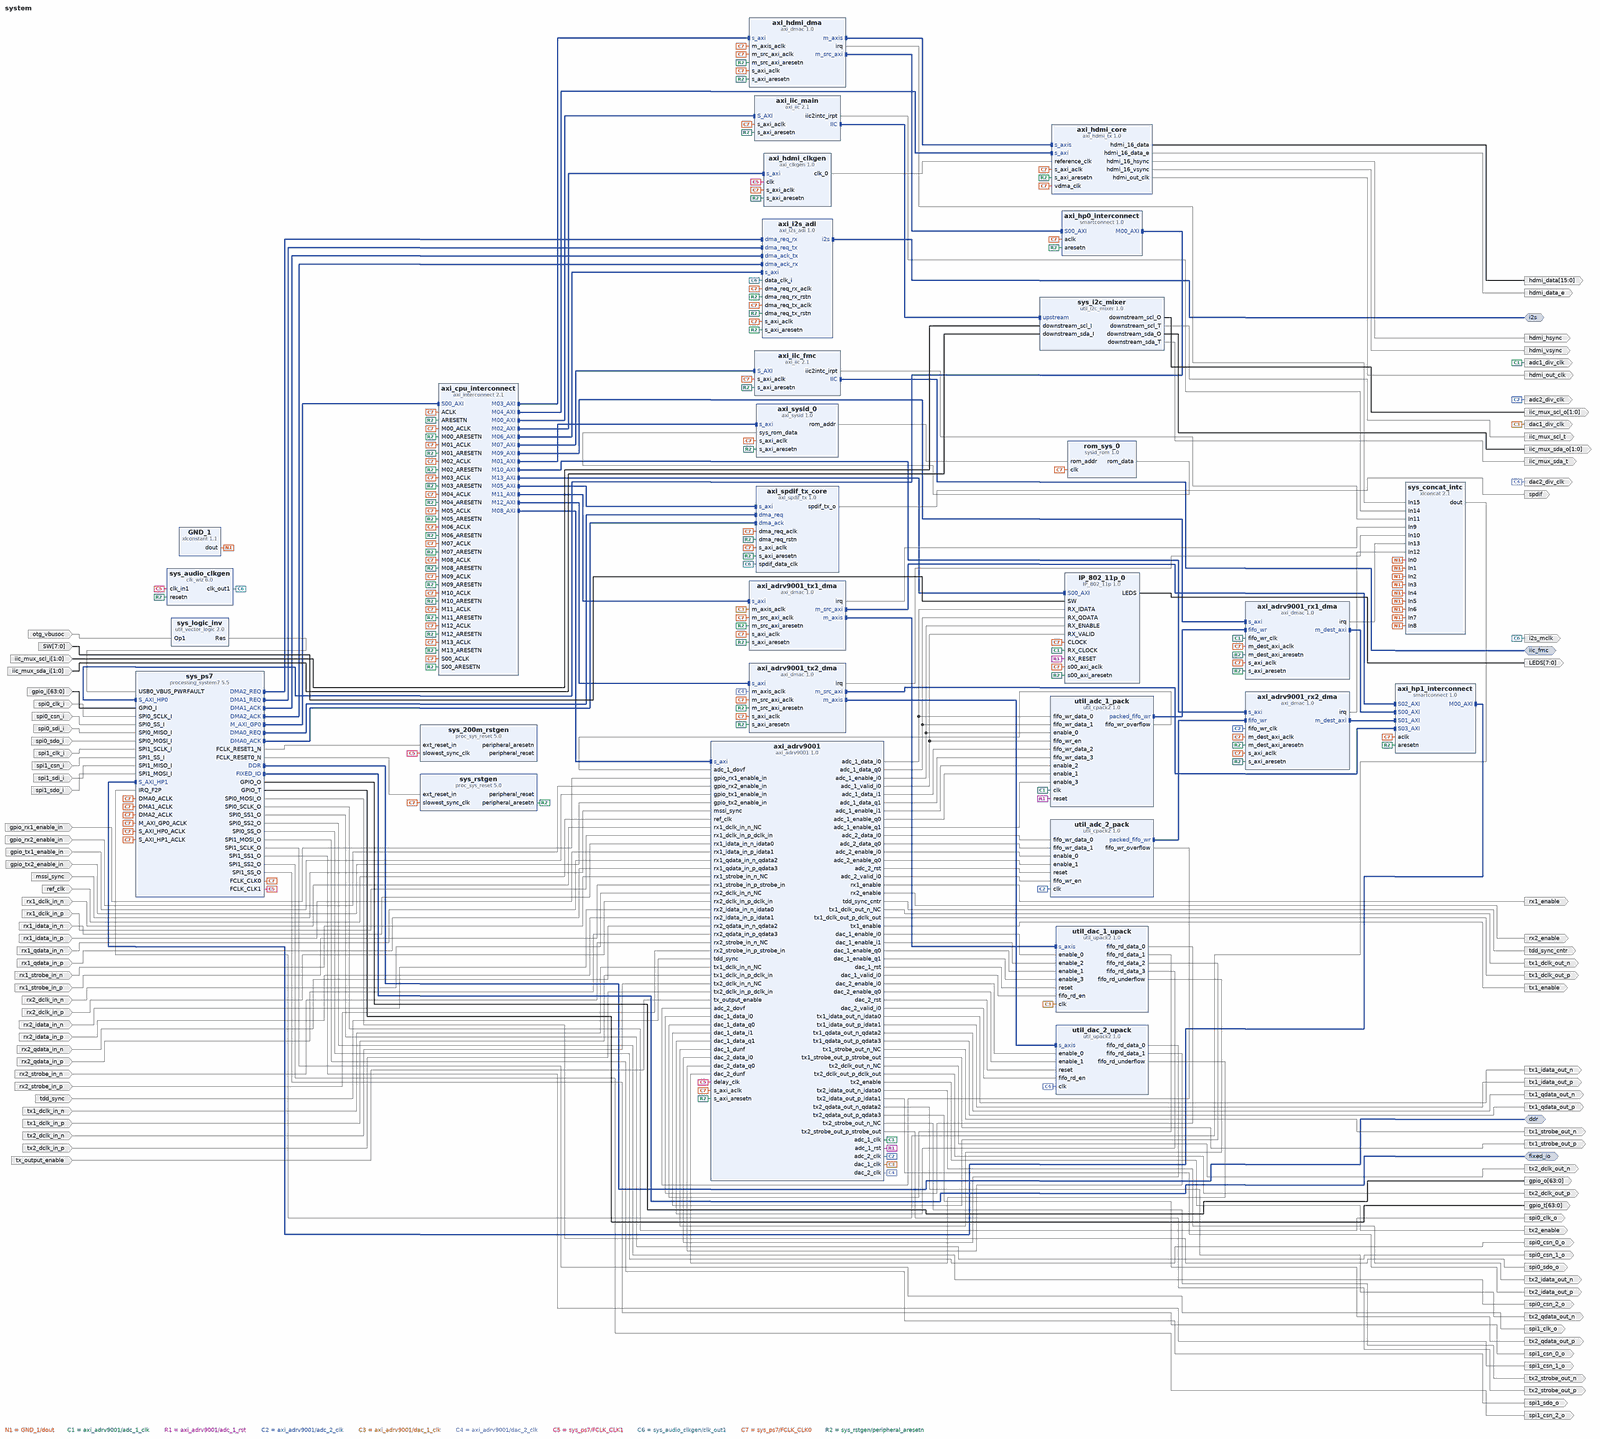
[diagram p0: block diagram of the top level, whole]
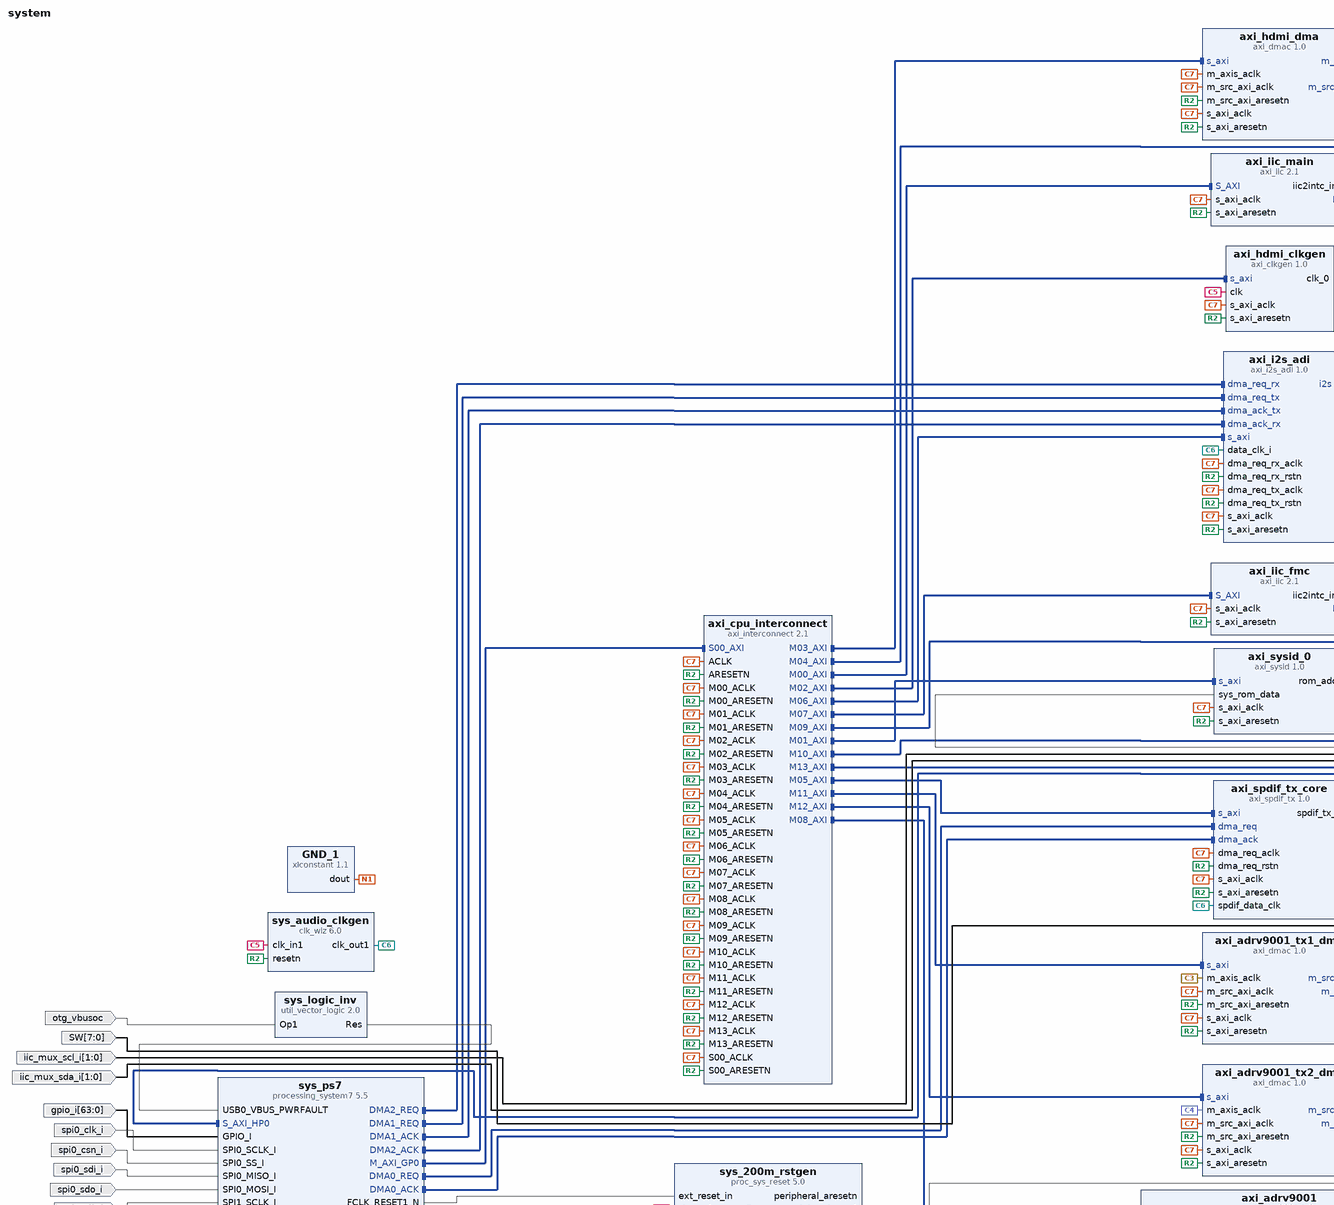
[diagram p1: block diagram of the top level, upper left part]
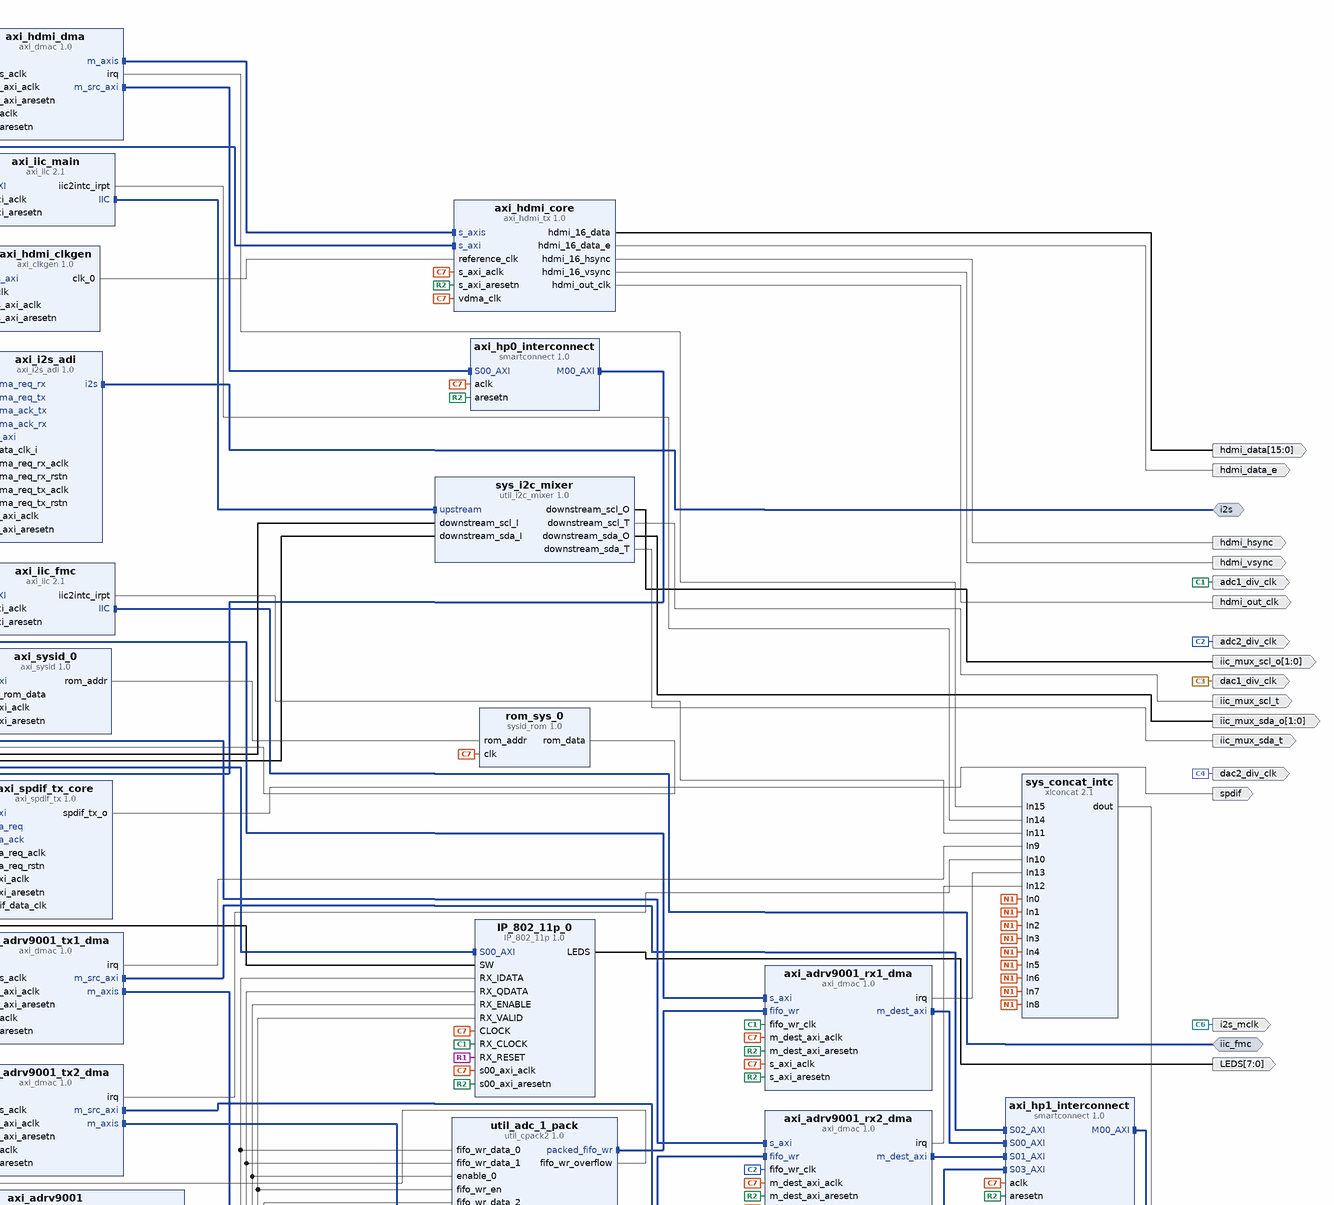
[diagram p2: block diagram of the top level, upper right part]
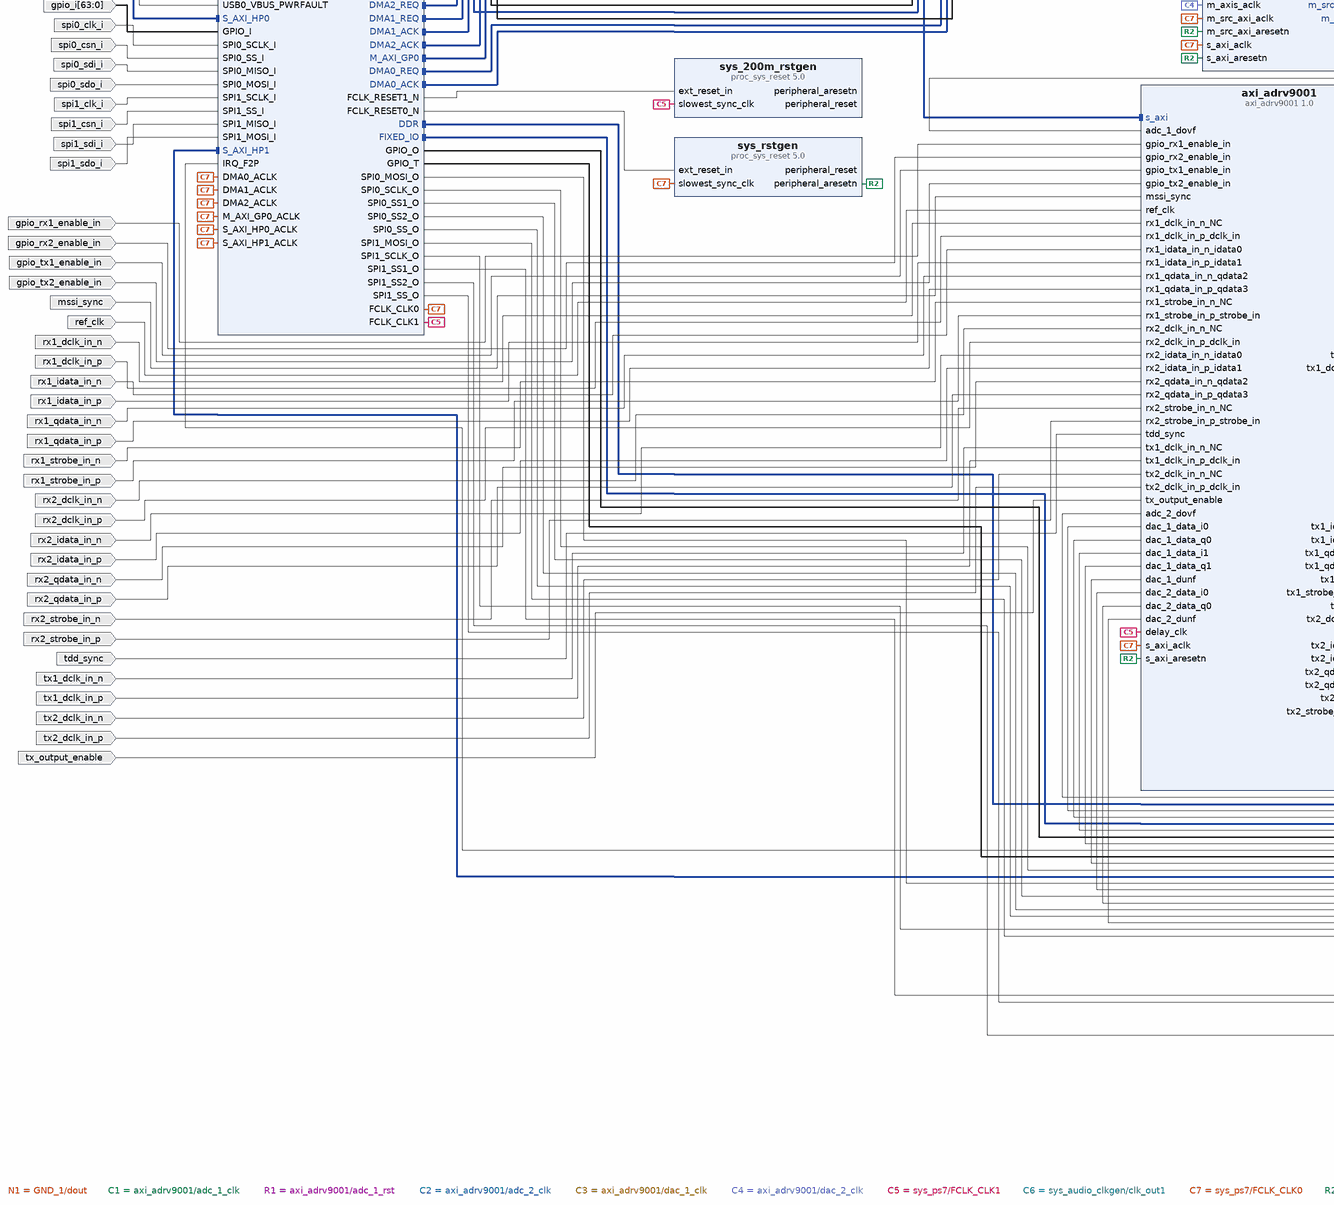
[diagram p3: block diagram of the top level, lower left part]
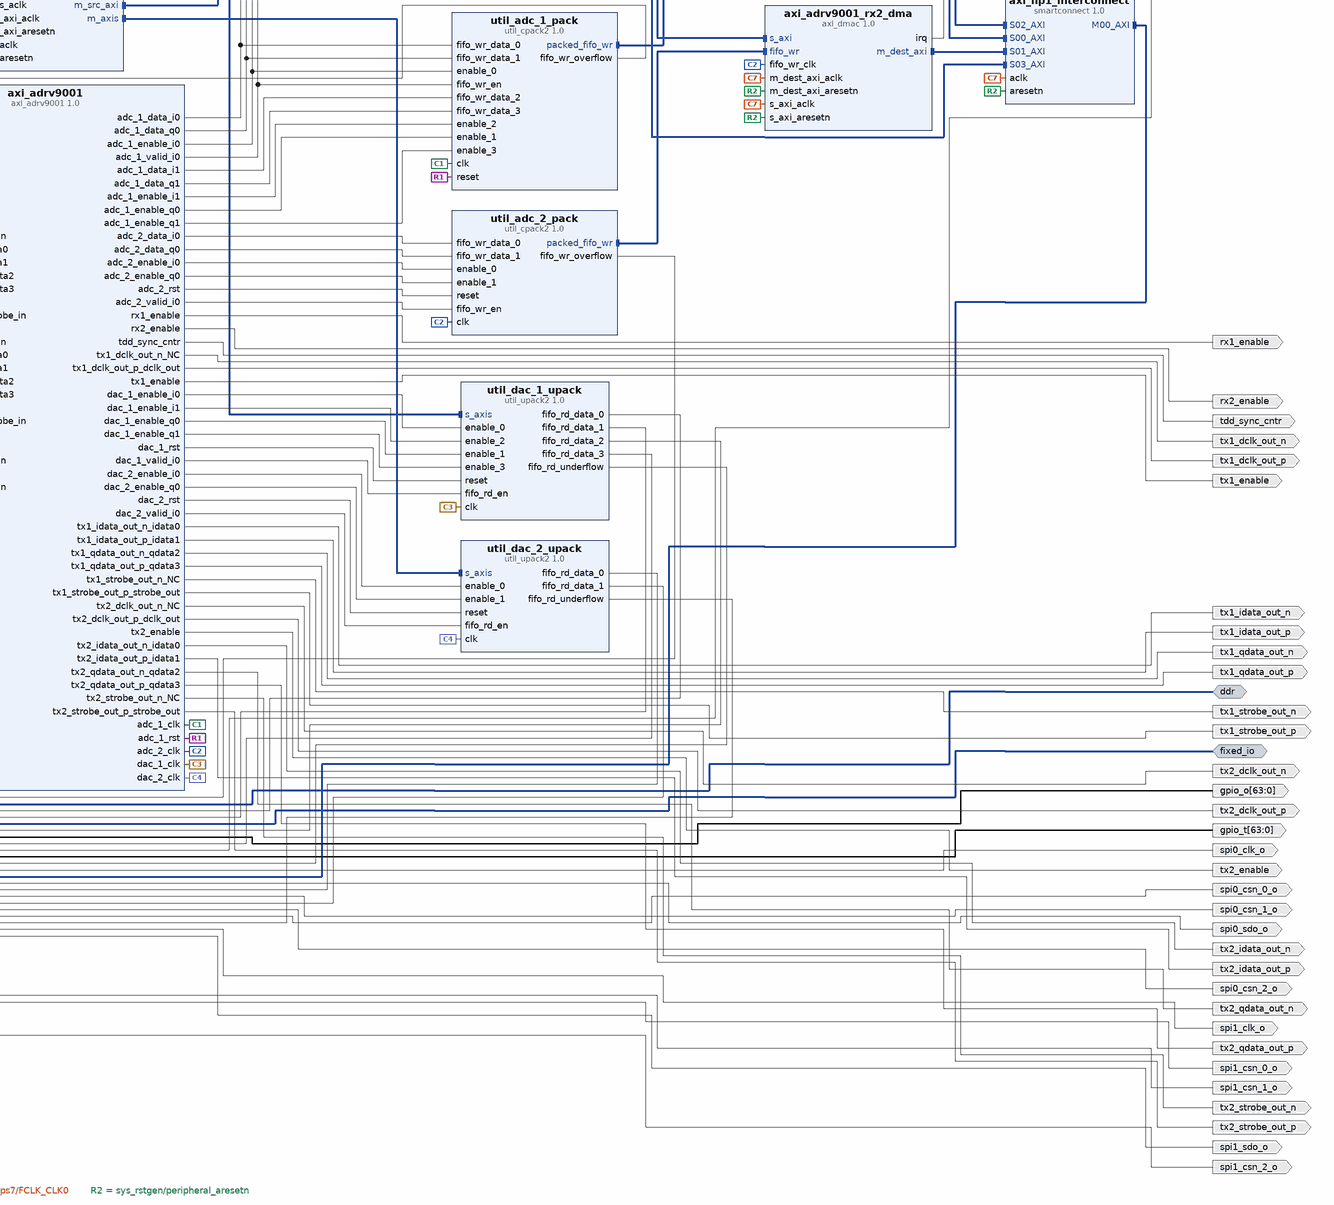
[diagram p4: block diagram of the top level, lower right part]
# Vivado block design system, xc7z020clg484-1, Vivado 2023.2.2
create_bd_design system

create_bd_intf_port -mode Master -vlnv xilinx.com:interface:ddrx_rtl:1.0 ddr
create_bd_intf_port -mode Master -vlnv xilinx.com:display_processing_system7:fixedio_rtl:1.0 fixed_io
create_bd_intf_port -mode Master -vlnv xilinx.com:interface:iic_rtl:1.0 iic_fmc
create_bd_intf_port -mode Master -vlnv analog.com:interface:i2s_rtl:1.0 i2s
create_bd_port -dir O spi0_csn_2_o
create_bd_port -dir O spi0_csn_1_o
create_bd_port -dir O spi0_csn_0_o
create_bd_port -dir I spi0_csn_i
create_bd_port -dir I spi0_clk_i
create_bd_port -dir O spi0_clk_o
create_bd_port -dir I spi0_sdo_i
create_bd_port -dir O spi0_sdo_o
create_bd_port -dir I spi0_sdi_i
create_bd_port -dir O spi1_csn_2_o
create_bd_port -dir O spi1_csn_1_o
create_bd_port -dir O spi1_csn_0_o
create_bd_port -dir I spi1_csn_i
create_bd_port -dir I spi1_clk_i
create_bd_port -dir O spi1_clk_o
create_bd_port -dir I spi1_sdo_i
create_bd_port -dir O spi1_sdo_o
create_bd_port -dir I spi1_sdi_i
create_bd_port -dir I -from 63 -to 0 gpio_i
create_bd_port -dir O -from 63 -to 0 gpio_o
create_bd_port -dir O -from 63 -to 0 gpio_t
create_bd_port -dir O hdmi_out_clk
create_bd_port -dir O hdmi_hsync
create_bd_port -dir O hdmi_vsync
create_bd_port -dir O hdmi_data_e
create_bd_port -dir O -from 15 -to 0 hdmi_data
create_bd_port -dir O -type clk i2s_mclk
create_bd_port -dir I -from 1 -to 0 iic_mux_scl_i
create_bd_port -dir O -from 1 -to 0 iic_mux_scl_o
create_bd_port -dir O iic_mux_scl_t
create_bd_port -dir I -from 1 -to 0 iic_mux_sda_i
create_bd_port -dir O -from 1 -to 0 iic_mux_sda_o
create_bd_port -dir O iic_mux_sda_t
create_bd_port -dir I otg_vbusoc
create_bd_port -dir O spdif
create_bd_port -dir O adc1_div_clk
create_bd_port -dir O adc2_div_clk
create_bd_port -dir O dac1_div_clk
create_bd_port -dir O dac2_div_clk
create_bd_port -dir I ref_clk
create_bd_port -dir I tx_output_enable
create_bd_port -dir I mssi_sync
create_bd_port -dir I rx1_dclk_in_n
create_bd_port -dir I rx1_dclk_in_p
create_bd_port -dir I rx1_idata_in_n
create_bd_port -dir I rx1_idata_in_p
create_bd_port -dir I rx1_qdata_in_n
create_bd_port -dir I rx1_qdata_in_p
create_bd_port -dir I rx1_strobe_in_n
create_bd_port -dir I rx1_strobe_in_p
create_bd_port -dir I rx2_dclk_in_n
create_bd_port -dir I rx2_dclk_in_p
create_bd_port -dir I rx2_idata_in_n
create_bd_port -dir I rx2_idata_in_p
create_bd_port -dir I rx2_qdata_in_n
create_bd_port -dir I rx2_qdata_in_p
create_bd_port -dir I rx2_strobe_in_n
create_bd_port -dir I rx2_strobe_in_p
create_bd_port -dir O tx1_dclk_out_n
create_bd_port -dir O tx1_dclk_out_p
create_bd_port -dir I tx1_dclk_in_n
create_bd_port -dir I tx1_dclk_in_p
create_bd_port -dir O tx1_idata_out_n
create_bd_port -dir O tx1_idata_out_p
create_bd_port -dir O tx1_qdata_out_n
create_bd_port -dir O tx1_qdata_out_p
create_bd_port -dir O tx1_strobe_out_n
create_bd_port -dir O tx1_strobe_out_p
create_bd_port -dir O tx2_dclk_out_n
create_bd_port -dir O tx2_dclk_out_p
create_bd_port -dir I tx2_dclk_in_n
create_bd_port -dir I tx2_dclk_in_p
create_bd_port -dir O tx2_idata_out_n
create_bd_port -dir O tx2_idata_out_p
create_bd_port -dir O tx2_qdata_out_n
create_bd_port -dir O tx2_qdata_out_p
create_bd_port -dir O tx2_strobe_out_n
create_bd_port -dir O tx2_strobe_out_p
create_bd_port -dir O rx1_enable
create_bd_port -dir O rx2_enable
create_bd_port -dir O tx1_enable
create_bd_port -dir O tx2_enable
create_bd_port -dir I gpio_rx1_enable_in
create_bd_port -dir I gpio_rx2_enable_in
create_bd_port -dir I gpio_tx1_enable_in
create_bd_port -dir I gpio_tx2_enable_in
create_bd_port -dir I tdd_sync
create_bd_port -dir O tdd_sync_cntr
create_bd_port -dir O -from 7 -to 0 LEDS
create_bd_port -dir I -from 7 -to 0 SW

create_bd_cell -type ip -vlnv xilinx.com:ip:processing_system7:5.5 sys_ps7
set_property -dict [list \
  CONFIG.PCW_APU_PERIPHERAL_FREQMHZ 666.666667 \
  CONFIG.PCW_ENET0_ENET0_IO {MIO 16 .. 27} \
  CONFIG.PCW_ENET0_GRP_MDIO_ENABLE 1 \
  CONFIG.PCW_ENET0_GRP_MDIO_IO {MIO 52 .. 53} \
  CONFIG.PCW_ENET0_PERIPHERAL_ENABLE 1 \
  CONFIG.PCW_ENET0_RESET_ENABLE 0 \
  CONFIG.PCW_ENET_RESET_ENABLE 1 \
  CONFIG.PCW_ENET_RESET_SELECT {Share reset pin} \
  CONFIG.PCW_EN_CLK1_PORT 1 \
  CONFIG.PCW_EN_RST1_PORT 1 \
  CONFIG.PCW_FCLK_CLK1_BUF TRUE \
  CONFIG.PCW_FPGA0_PERIPHERAL_FREQMHZ 100.0 \
  CONFIG.PCW_FPGA1_PERIPHERAL_FREQMHZ 200.0 \
  CONFIG.PCW_FPGA2_PERIPHERAL_FREQMHZ 50.000000 \
  CONFIG.PCW_FPGA_FCLK1_ENABLE 1 \
  CONFIG.PCW_GPIO_EMIO_GPIO_ENABLE 1 \
  CONFIG.PCW_GPIO_EMIO_GPIO_IO 64 \
  CONFIG.PCW_GPIO_MIO_GPIO_ENABLE 1 \
  CONFIG.PCW_GPIO_MIO_GPIO_IO MIO \
  CONFIG.PCW_I2C_RESET_ENABLE 1 \
  CONFIG.PCW_IMPORT_BOARD_PRESET ZedBoard \
  CONFIG.PCW_IRQ_F2P_INTR 1 \
  CONFIG.PCW_IRQ_F2P_MODE REVERSE \
  CONFIG.PCW_PRESET_BANK1_VOLTAGE {LVCMOS 1.8V} \
  CONFIG.PCW_QSPI_GRP_SINGLE_SS_ENABLE 1 \
  CONFIG.PCW_QSPI_GRP_SINGLE_SS_IO {MIO 1 .. 6} \
  CONFIG.PCW_QSPI_PERIPHERAL_ENABLE 1 \
  CONFIG.PCW_QSPI_PERIPHERAL_FREQMHZ 200.000000 \
  CONFIG.PCW_QSPI_QSPI_IO {MIO 1 .. 6} \
  CONFIG.PCW_SD0_GRP_CD_ENABLE 1 \
  CONFIG.PCW_SD0_GRP_CD_IO {MIO 47} \
  CONFIG.PCW_SD0_GRP_WP_ENABLE 1 \
  CONFIG.PCW_SD0_GRP_WP_IO {MIO 46} \
  CONFIG.PCW_SD0_PERIPHERAL_ENABLE 1 \
  CONFIG.PCW_SD0_SD0_IO {MIO 40 .. 45} \
  CONFIG.PCW_SDIO_PERIPHERAL_FREQMHZ 50 \
  CONFIG.PCW_SINGLE_QSPI_DATA_MODE x4 \
  CONFIG.PCW_SPI0_PERIPHERAL_ENABLE 1 \
  CONFIG.PCW_SPI0_SPI0_IO EMIO \
  CONFIG.PCW_SPI1_PERIPHERAL_ENABLE 1 \
  CONFIG.PCW_SPI1_SPI1_IO EMIO \
  CONFIG.PCW_UART1_PERIPHERAL_ENABLE 1 \
  CONFIG.PCW_UART1_UART1_IO {MIO 48 .. 49} \
  CONFIG.PCW_UART_PERIPHERAL_FREQMHZ 50 \
  CONFIG.PCW_UIPARAM_DDR_FREQ_MHZ 533.333313 \
  CONFIG.PCW_UIPARAM_DDR_PARTNO {MT41J128M16 HA-15E} \
  CONFIG.PCW_USB0_PERIPHERAL_ENABLE 1 \
  CONFIG.PCW_USB0_RESET_ENABLE 0 \
  CONFIG.PCW_USB0_USB0_IO {MIO 28 .. 39} \
  CONFIG.PCW_USB_RESET_ENABLE 1 \
  CONFIG.PCW_USB_RESET_SELECT {Share reset pin} \
  CONFIG.PCW_USE_DMA0 1 \
  CONFIG.PCW_USE_DMA1 1 \
  CONFIG.PCW_USE_DMA2 1 \
  CONFIG.PCW_USE_FABRIC_INTERRUPT 1 \
  CONFIG.PCW_USE_S_AXI_HP0 1 \
  CONFIG.PCW_USE_S_AXI_HP1 1 \
] [get_bd_cells sys_ps7]
# 425 more settings of sys_ps7 are not shown: defaults, MIO pin electricals, DDR timing, and values the tool derives
create_bd_cell -type ip -vlnv xilinx.com:ip:axi_iic:2.1 axi_iic_main
set_property -dict {CONFIG.IIC_BOARD_INTERFACE Custom CONFIG.USE_BOARD_FLOW true} [get_bd_cells axi_iic_main]
create_bd_cell -type ip -vlnv analog.com:user:util_i2c_mixer:1.0 sys_i2c_mixer
create_bd_cell -type ip -vlnv xilinx.com:ip:xlconcat:2.1 sys_concat_intc
set_property -dict {CONFIG.NUM_PORTS 16} [get_bd_cells sys_concat_intc]
create_bd_cell -type ip -vlnv xilinx.com:ip:proc_sys_reset:5.0 sys_rstgen
set_property -dict {CONFIG.C_EXT_RST_WIDTH 1} [get_bd_cells sys_rstgen]
create_bd_cell -type ip -vlnv xilinx.com:ip:proc_sys_reset:5.0 sys_200m_rstgen
set_property -dict {CONFIG.C_EXT_RST_WIDTH 1} [get_bd_cells sys_200m_rstgen]
create_bd_cell -type ip -vlnv xilinx.com:ip:util_vector_logic:2.0 sys_logic_inv
set_property -dict {CONFIG.C_OPERATION not CONFIG.C_SIZE 1} [get_bd_cells sys_logic_inv]
create_bd_cell -type ip -vlnv analog.com:user:axi_clkgen:1.0 axi_hdmi_clkgen
create_bd_cell -type ip -vlnv analog.com:user:axi_hdmi_tx:1.0 axi_hdmi_core
set_property -dict {CONFIG.INTERFACE 16_BIT} [get_bd_cells axi_hdmi_core]
create_bd_cell -type ip -vlnv analog.com:user:axi_dmac:1.0 axi_hdmi_dma
set_property -dict [list \
  CONFIG.AXI_SLICE_DEST false \
  CONFIG.AXI_SLICE_SRC false \
  CONFIG.CYCLIC true \
  CONFIG.DMA_2D_TRANSFER true \
  CONFIG.DMA_DATA_WIDTH_SRC 64 \
  CONFIG.DMA_TYPE_DEST 1 \
  CONFIG.DMA_TYPE_SRC 0 \
] [get_bd_cells axi_hdmi_dma]
create_bd_cell -type ip -vlnv xilinx.com:ip:clk_wiz:6.0 sys_audio_clkgen
set_property -dict [list \
  CONFIG.CLKIN1_JITTER_PS 50.0 \
  CONFIG.CLKOUT1_JITTER 327.996 \
  CONFIG.CLKOUT1_PHASE_ERROR 264.435 \
  CONFIG.CLKOUT1_REQUESTED_OUT_FREQ 12.288 \
  CONFIG.MMCM_CLKFBOUT_MULT_F 44.375 \
  CONFIG.MMCM_CLKIN1_PERIOD 5.000 \
  CONFIG.MMCM_CLKIN2_PERIOD 10.0 \
  CONFIG.MMCM_CLKOUT0_DIVIDE_F 80.250 \
  CONFIG.MMCM_DIVCLK_DIVIDE 9 \
  CONFIG.PRIM_SOURCE No_buffer \
  CONFIG.RESET_PORT resetn \
  CONFIG.RESET_TYPE ACTIVE_LOW \
  CONFIG.USE_LOCKED false \
  CONFIG.USE_PHASE_ALIGNMENT false \
  CONFIG.USE_RESET true \
] [get_bd_cells sys_audio_clkgen]
create_bd_cell -type ip -vlnv analog.com:user:axi_spdif_tx:1.0 axi_spdif_tx_core
set_property -dict {CONFIG.DMA_TYPE 1 CONFIG.S_AXI_ADDRESS_WIDTH 16} [get_bd_cells axi_spdif_tx_core]
create_bd_cell -type ip -vlnv analog.com:user:axi_i2s_adi:1.0 axi_i2s_adi
set_property -dict {CONFIG.DMA_TYPE 1 CONFIG.S_AXI_ADDRESS_WIDTH 16} [get_bd_cells axi_i2s_adi]
create_bd_cell -type ip -vlnv xilinx.com:ip:axi_iic:2.1 axi_iic_fmc
create_bd_cell -type ip -vlnv analog.com:user:axi_sysid:1.0 axi_sysid_0
set_property -dict {CONFIG.ROM_ADDR_BITS 9} [get_bd_cells axi_sysid_0]
create_bd_cell -type ip -vlnv analog.com:user:sysid_rom:1.0 rom_sys_0
set_property -dict [list \
  CONFIG.PATH_TO_FILE c:/zedboard_adrv9002_project/adi_hdl_2022_r2/projects/adrv9001/zed/mem_init_sys.txt \
  CONFIG.ROM_ADDR_BITS 9 \
] [get_bd_cells rom_sys_0]
create_bd_cell -type ip -vlnv xilinx.com:ip:xlconstant:1.1 GND_1
set_property -dict {CONFIG.CONST_VAL 0 CONFIG.CONST_WIDTH 1} [get_bd_cells GND_1]
create_bd_cell -type ip -vlnv xilinx.com:ip:axi_interconnect:2.1 axi_cpu_interconnect
set_property -dict {CONFIG.NUM_MI 14} [get_bd_cells axi_cpu_interconnect]
create_bd_cell -type ip -vlnv xilinx.com:ip:smartconnect:1.0 axi_hp0_interconnect
set_property -dict {CONFIG.NUM_MI 1 CONFIG.NUM_SI 1} [get_bd_cells axi_hp0_interconnect]
create_bd_cell -type ip -vlnv analog.com:user:axi_adrv9001:1.0 axi_adrv9001
set_property -dict [list \
  CONFIG.CMOS_LVDS_N 1 \
  CONFIG.DEV_PACKAGE 14 \
  CONFIG.FPGA_FAMILY 4 \
  CONFIG.FPGA_TECHNOLOGY 1 \
  CONFIG.RX_USE_BUFG 1 \
  CONFIG.SPEED_GRADE 10 \
  CONFIG.TX_USE_BUFG 1 \
] [get_bd_cells axi_adrv9001]
create_bd_cell -type ip -vlnv analog.com:user:axi_dmac:1.0 axi_adrv9001_rx1_dma
set_property -dict [list \
  CONFIG.AXI_SLICE_DEST false \
  CONFIG.AXI_SLICE_SRC false \
  CONFIG.CYCLIC false \
  CONFIG.DMA_2D_TRANSFER false \
  CONFIG.DMA_DATA_WIDTH_SRC 64 \
  CONFIG.DMA_TYPE_DEST 0 \
  CONFIG.DMA_TYPE_SRC 2 \
  CONFIG.SYNC_TRANSFER_START false \
] [get_bd_cells axi_adrv9001_rx1_dma]
create_bd_cell -type ip -vlnv analog.com:user:util_cpack2:1.0 util_adc_1_pack
set_property -dict {CONFIG.NUM_OF_CHANNELS 4 CONFIG.SAMPLE_DATA_WIDTH 16} [get_bd_cells util_adc_1_pack]
create_bd_cell -type ip -vlnv analog.com:user:axi_dmac:1.0 axi_adrv9001_rx2_dma
set_property -dict [list \
  CONFIG.AXI_SLICE_DEST false \
  CONFIG.AXI_SLICE_SRC false \
  CONFIG.CYCLIC false \
  CONFIG.DMA_2D_TRANSFER false \
  CONFIG.DMA_DATA_WIDTH_SRC 32 \
  CONFIG.DMA_TYPE_DEST 0 \
  CONFIG.DMA_TYPE_SRC 2 \
  CONFIG.SYNC_TRANSFER_START false \
] [get_bd_cells axi_adrv9001_rx2_dma]
create_bd_cell -type ip -vlnv analog.com:user:util_cpack2:1.0 util_adc_2_pack
set_property -dict {CONFIG.NUM_OF_CHANNELS 2 CONFIG.SAMPLE_DATA_WIDTH 16} [get_bd_cells util_adc_2_pack]
create_bd_cell -type ip -vlnv analog.com:user:axi_dmac:1.0 axi_adrv9001_tx1_dma
set_property -dict [list \
  CONFIG.AXI_SLICE_DEST false \
  CONFIG.AXI_SLICE_SRC false \
  CONFIG.CYCLIC true \
  CONFIG.DMA_2D_TRANSFER false \
  CONFIG.DMA_DATA_WIDTH_DEST 64 \
  CONFIG.DMA_TYPE_DEST 1 \
  CONFIG.DMA_TYPE_SRC 0 \
] [get_bd_cells axi_adrv9001_tx1_dma]
create_bd_cell -type ip -vlnv analog.com:user:util_upack2:1.0 util_dac_1_upack
set_property -dict {CONFIG.NUM_OF_CHANNELS 4 CONFIG.SAMPLE_DATA_WIDTH 16} [get_bd_cells util_dac_1_upack]
create_bd_cell -type ip -vlnv analog.com:user:axi_dmac:1.0 axi_adrv9001_tx2_dma
set_property -dict [list \
  CONFIG.AXI_SLICE_DEST false \
  CONFIG.AXI_SLICE_SRC false \
  CONFIG.CYCLIC true \
  CONFIG.DMA_2D_TRANSFER false \
  CONFIG.DMA_DATA_WIDTH_DEST 32 \
  CONFIG.DMA_TYPE_DEST 1 \
  CONFIG.DMA_TYPE_SRC 0 \
] [get_bd_cells axi_adrv9001_tx2_dma]
create_bd_cell -type ip -vlnv analog.com:user:util_upack2:1.0 util_dac_2_upack
set_property -dict {CONFIG.NUM_OF_CHANNELS 2 CONFIG.SAMPLE_DATA_WIDTH 16} [get_bd_cells util_dac_2_upack]
create_bd_cell -type ip -vlnv xilinx.com:ip:smartconnect:1.0 axi_hp1_interconnect
set_property -dict {CONFIG.NUM_MI 1 CONFIG.NUM_SI 4} [get_bd_cells axi_hp1_interconnect]
create_bd_cell -type ip -vlnv xilinx.com:user:IP_802_11p:1.0 IP_802_11p_0

# ---- connections ----

connect_bd_intf_net [get_bd_intf_pins axi_cpu_interconnect/S00_AXI] [get_bd_intf_pins sys_ps7/M_AXI_GP0]
connect_bd_intf_net [get_bd_intf_pins axi_hp1_interconnect/S00_AXI] [get_bd_intf_pins axi_adrv9001_rx1_dma/m_dest_axi]
connect_bd_intf_net [get_bd_intf_pins axi_hp1_interconnect/S01_AXI] [get_bd_intf_pins axi_adrv9001_rx2_dma/m_dest_axi]
connect_bd_intf_net [get_bd_intf_pins axi_adrv9001_tx1_dma/m_axis] [get_bd_intf_pins util_dac_1_upack/s_axis]
connect_bd_intf_net [get_bd_intf_pins axi_hp1_interconnect/S02_AXI] [get_bd_intf_pins axi_adrv9001_tx1_dma/m_src_axi]
connect_bd_intf_net [get_bd_intf_pins axi_adrv9001_tx2_dma/m_axis] [get_bd_intf_pins util_dac_2_upack/s_axis]
connect_bd_intf_net [get_bd_intf_pins axi_hp1_interconnect/S03_AXI] [get_bd_intf_pins axi_adrv9001_tx2_dma/m_src_axi]
connect_bd_intf_net [get_bd_intf_pins axi_cpu_interconnect/M00_AXI] [get_bd_intf_pins axi_iic_main/S_AXI]
connect_bd_intf_net [get_bd_intf_pins axi_cpu_interconnect/M01_AXI] [get_bd_intf_pins axi_sysid_0/s_axi]
connect_bd_intf_net [get_bd_intf_pins axi_cpu_interconnect/M02_AXI] [get_bd_intf_pins axi_hdmi_clkgen/s_axi]
connect_bd_intf_net [get_bd_intf_pins axi_cpu_interconnect/M03_AXI] [get_bd_intf_pins axi_hdmi_dma/s_axi]
connect_bd_intf_net [get_bd_intf_pins axi_cpu_interconnect/M04_AXI] [get_bd_intf_pins axi_hdmi_core/s_axi]
connect_bd_intf_net [get_bd_intf_pins axi_cpu_interconnect/M05_AXI] [get_bd_intf_pins axi_spdif_tx_core/s_axi]
connect_bd_intf_net [get_bd_intf_pins axi_cpu_interconnect/M06_AXI] [get_bd_intf_pins axi_i2s_adi/s_axi]
connect_bd_intf_net [get_bd_intf_pins axi_cpu_interconnect/M07_AXI] [get_bd_intf_pins axi_iic_fmc/S_AXI]
connect_bd_intf_net [get_bd_intf_pins axi_cpu_interconnect/M08_AXI] [get_bd_intf_pins axi_adrv9001/s_axi]
connect_bd_intf_net [get_bd_intf_pins axi_cpu_interconnect/M09_AXI] [get_bd_intf_pins axi_adrv9001_rx1_dma/s_axi]
connect_bd_intf_net [get_bd_intf_pins axi_cpu_interconnect/M10_AXI] [get_bd_intf_pins axi_adrv9001_rx2_dma/s_axi]
connect_bd_intf_net [get_bd_intf_pins axi_cpu_interconnect/M11_AXI] [get_bd_intf_pins axi_adrv9001_tx1_dma/s_axi]
connect_bd_intf_net [get_bd_intf_pins axi_cpu_interconnect/M12_AXI] [get_bd_intf_pins axi_adrv9001_tx2_dma/s_axi]
connect_bd_intf_net [get_bd_intf_pins axi_cpu_interconnect/M13_AXI] [get_bd_intf_pins IP_802_11p_0/S00_AXI]
connect_bd_intf_net [get_bd_intf_pins axi_hdmi_dma/m_axis] [get_bd_intf_pins axi_hdmi_core/s_axis]
connect_bd_intf_net [get_bd_intf_pins axi_hp0_interconnect/S00_AXI] [get_bd_intf_pins axi_hdmi_dma/m_src_axi]
connect_bd_intf_net [get_bd_intf_pins axi_hp0_interconnect/M00_AXI] [get_bd_intf_pins sys_ps7/S_AXI_HP0]
connect_bd_intf_net [get_bd_intf_pins axi_hp1_interconnect/M00_AXI] [get_bd_intf_pins sys_ps7/S_AXI_HP1]
connect_bd_intf_net [get_bd_intf_pins sys_ps7/DMA2_REQ] [get_bd_intf_pins axi_i2s_adi/dma_req_rx]
connect_bd_intf_net [get_bd_intf_pins sys_ps7/DMA1_REQ] [get_bd_intf_pins axi_i2s_adi/dma_req_tx]
connect_bd_intf_net [get_bd_intf_ports i2s] [get_bd_intf_pins axi_i2s_adi/i2s]
connect_bd_intf_net [get_bd_intf_ports iic_fmc] [get_bd_intf_pins axi_iic_fmc/IIC]
connect_bd_intf_net [get_bd_intf_pins axi_iic_main/IIC] [get_bd_intf_pins sys_i2c_mixer/upstream]
connect_bd_intf_net [get_bd_intf_pins sys_ps7/DMA0_REQ] [get_bd_intf_pins axi_spdif_tx_core/dma_req]
connect_bd_intf_net [get_bd_intf_ports ddr] [get_bd_intf_pins sys_ps7/DDR]
connect_bd_intf_net [get_bd_intf_pins sys_ps7/DMA0_ACK] [get_bd_intf_pins axi_spdif_tx_core/dma_ack]
connect_bd_intf_net [get_bd_intf_pins sys_ps7/DMA1_ACK] [get_bd_intf_pins axi_i2s_adi/dma_ack_tx]
connect_bd_intf_net [get_bd_intf_pins sys_ps7/DMA2_ACK] [get_bd_intf_pins axi_i2s_adi/dma_ack_rx]
connect_bd_intf_net [get_bd_intf_ports fixed_io] [get_bd_intf_pins sys_ps7/FIXED_IO]
connect_bd_intf_net [get_bd_intf_pins util_adc_1_pack/packed_fifo_wr] [get_bd_intf_pins axi_adrv9001_rx1_dma/fifo_wr]
connect_bd_intf_net [get_bd_intf_pins util_adc_2_pack/packed_fifo_wr] [get_bd_intf_pins axi_adrv9001_rx2_dma/fifo_wr]
connect_bd_net [get_bd_pins GND_1/dout] \
  [get_bd_pins sys_concat_intc/In0] [get_bd_pins sys_concat_intc/In1] [get_bd_pins sys_concat_intc/In2] \
  [get_bd_pins sys_concat_intc/In3] [get_bd_pins sys_concat_intc/In4] [get_bd_pins sys_concat_intc/In5] \
  [get_bd_pins sys_concat_intc/In6] [get_bd_pins sys_concat_intc/In7] [get_bd_pins sys_concat_intc/In8]
connect_bd_net [get_bd_pins IP_802_11p_0/LEDS] [get_bd_ports LEDS]
connect_bd_net [get_bd_ports SW] [get_bd_pins IP_802_11p_0/SW]
connect_bd_net [get_bd_pins axi_adrv9001/adc_1_clk] \
  [get_bd_pins axi_adrv9001_rx1_dma/fifo_wr_clk] [get_bd_pins util_adc_1_pack/clk] [get_bd_ports adc1_div_clk] \
  [get_bd_pins IP_802_11p_0/RX_CLOCK]
connect_bd_net [get_bd_pins axi_adrv9001/adc_1_data_i0] [get_bd_pins util_adc_1_pack/fifo_wr_data_0] [get_bd_pins IP_802_11p_0/RX_IDATA]
connect_bd_net [get_bd_pins axi_adrv9001/adc_1_data_i1] [get_bd_pins util_adc_1_pack/fifo_wr_data_2]
connect_bd_net [get_bd_pins axi_adrv9001/adc_1_data_q0] [get_bd_pins util_adc_1_pack/fifo_wr_data_1] [get_bd_pins IP_802_11p_0/RX_QDATA]
connect_bd_net [get_bd_pins axi_adrv9001/adc_1_data_q1] [get_bd_pins util_adc_1_pack/fifo_wr_data_3]
connect_bd_net [get_bd_pins axi_adrv9001/adc_1_enable_i0] [get_bd_pins util_adc_1_pack/enable_0] [get_bd_pins IP_802_11p_0/RX_ENABLE]
connect_bd_net [get_bd_pins axi_adrv9001/adc_1_enable_i1] [get_bd_pins util_adc_1_pack/enable_2]
connect_bd_net [get_bd_pins axi_adrv9001/adc_1_enable_q0] [get_bd_pins util_adc_1_pack/enable_1]
connect_bd_net [get_bd_pins axi_adrv9001/adc_1_enable_q1] [get_bd_pins util_adc_1_pack/enable_3]
connect_bd_net [get_bd_pins axi_adrv9001/adc_1_rst] [get_bd_pins util_adc_1_pack/reset] [get_bd_pins IP_802_11p_0/RX_RESET]
connect_bd_net [get_bd_pins axi_adrv9001/adc_1_valid_i0] [get_bd_pins util_adc_1_pack/fifo_wr_en] [get_bd_pins IP_802_11p_0/RX_VALID]
connect_bd_net [get_bd_pins axi_adrv9001/adc_2_clk] \
  [get_bd_pins axi_adrv9001_rx2_dma/fifo_wr_clk] [get_bd_pins util_adc_2_pack/clk] [get_bd_ports adc2_div_clk]
connect_bd_net [get_bd_pins axi_adrv9001/adc_2_data_i0] [get_bd_pins util_adc_2_pack/fifo_wr_data_0]
connect_bd_net [get_bd_pins axi_adrv9001/adc_2_data_q0] [get_bd_pins util_adc_2_pack/fifo_wr_data_1]
connect_bd_net [get_bd_pins axi_adrv9001/adc_2_enable_i0] [get_bd_pins util_adc_2_pack/enable_0]
connect_bd_net [get_bd_pins axi_adrv9001/adc_2_enable_q0] [get_bd_pins util_adc_2_pack/enable_1]
connect_bd_net [get_bd_pins axi_adrv9001/adc_2_rst] [get_bd_pins util_adc_2_pack/reset]
connect_bd_net [get_bd_pins axi_adrv9001/adc_2_valid_i0] [get_bd_pins util_adc_2_pack/fifo_wr_en]
connect_bd_net [get_bd_pins axi_adrv9001/dac_1_clk] \
  [get_bd_pins axi_adrv9001_tx1_dma/m_axis_aclk] [get_bd_pins util_dac_1_upack/clk] [get_bd_ports dac1_div_clk]
connect_bd_net [get_bd_pins axi_adrv9001/dac_1_enable_i0] [get_bd_pins util_dac_1_upack/enable_0]
connect_bd_net [get_bd_pins axi_adrv9001/dac_1_enable_i1] [get_bd_pins util_dac_1_upack/enable_2]
connect_bd_net [get_bd_pins axi_adrv9001/dac_1_enable_q0] [get_bd_pins util_dac_1_upack/enable_1]
connect_bd_net [get_bd_pins axi_adrv9001/dac_1_enable_q1] [get_bd_pins util_dac_1_upack/enable_3]
connect_bd_net [get_bd_pins axi_adrv9001/dac_1_rst] [get_bd_pins util_dac_1_upack/reset]
connect_bd_net [get_bd_pins axi_adrv9001/dac_1_valid_i0] [get_bd_pins util_dac_1_upack/fifo_rd_en]
connect_bd_net [get_bd_pins axi_adrv9001/dac_2_clk] \
  [get_bd_pins axi_adrv9001_tx2_dma/m_axis_aclk] [get_bd_pins util_dac_2_upack/clk] [get_bd_ports dac2_div_clk]
connect_bd_net [get_bd_pins axi_adrv9001/dac_2_enable_i0] [get_bd_pins util_dac_2_upack/enable_0]
connect_bd_net [get_bd_pins axi_adrv9001/dac_2_enable_q0] [get_bd_pins util_dac_2_upack/enable_1]
connect_bd_net [get_bd_pins axi_adrv9001/dac_2_rst] [get_bd_pins util_dac_2_upack/reset]
connect_bd_net [get_bd_pins axi_adrv9001/dac_2_valid_i0] [get_bd_pins util_dac_2_upack/fifo_rd_en]
connect_bd_net [get_bd_pins axi_adrv9001_rx1_dma/irq] [get_bd_pins sys_concat_intc/In13]
connect_bd_net [get_bd_pins axi_adrv9001/rx1_enable] [get_bd_ports rx1_enable]
connect_bd_net [get_bd_pins axi_adrv9001_rx2_dma/irq] [get_bd_pins sys_concat_intc/In12]
connect_bd_net [get_bd_pins axi_adrv9001/rx2_enable] [get_bd_ports rx2_enable]
connect_bd_net [get_bd_pins axi_adrv9001/tdd_sync_cntr] [get_bd_ports tdd_sync_cntr]
connect_bd_net [get_bd_pins axi_adrv9001/tx1_dclk_out_n_NC] [get_bd_ports tx1_dclk_out_n]
connect_bd_net [get_bd_pins axi_adrv9001/tx1_dclk_out_p_dclk_out] [get_bd_ports tx1_dclk_out_p]
connect_bd_net [get_bd_pins axi_adrv9001_tx1_dma/irq] [get_bd_pins sys_concat_intc/In9]
connect_bd_net [get_bd_pins axi_adrv9001/tx1_enable] [get_bd_ports tx1_enable]
connect_bd_net [get_bd_pins axi_adrv9001/tx1_idata_out_n_idata0] [get_bd_ports tx1_idata_out_n]
connect_bd_net [get_bd_pins axi_adrv9001/tx1_idata_out_p_idata1] [get_bd_ports tx1_idata_out_p]
connect_bd_net [get_bd_pins axi_adrv9001/tx1_qdata_out_n_qdata2] [get_bd_ports tx1_qdata_out_n]
connect_bd_net [get_bd_pins axi_adrv9001/tx1_qdata_out_p_qdata3] [get_bd_ports tx1_qdata_out_p]
connect_bd_net [get_bd_pins axi_adrv9001/tx1_strobe_out_n_NC] [get_bd_ports tx1_strobe_out_n]
connect_bd_net [get_bd_pins axi_adrv9001/tx1_strobe_out_p_strobe_out] [get_bd_ports tx1_strobe_out_p]
connect_bd_net [get_bd_pins axi_adrv9001/tx2_dclk_out_n_NC] [get_bd_ports tx2_dclk_out_n]
connect_bd_net [get_bd_pins axi_adrv9001/tx2_dclk_out_p_dclk_out] [get_bd_ports tx2_dclk_out_p]
connect_bd_net [get_bd_pins axi_adrv9001_tx2_dma/irq] [get_bd_pins sys_concat_intc/In10]
connect_bd_net [get_bd_pins axi_adrv9001/tx2_enable] [get_bd_ports tx2_enable]
connect_bd_net [get_bd_pins axi_adrv9001/tx2_idata_out_n_idata0] [get_bd_ports tx2_idata_out_n]
connect_bd_net [get_bd_pins axi_adrv9001/tx2_idata_out_p_idata1] [get_bd_ports tx2_idata_out_p]
connect_bd_net [get_bd_pins axi_adrv9001/tx2_qdata_out_n_qdata2] [get_bd_ports tx2_qdata_out_n]
connect_bd_net [get_bd_pins axi_adrv9001/tx2_qdata_out_p_qdata3] [get_bd_ports tx2_qdata_out_p]
connect_bd_net [get_bd_pins axi_adrv9001/tx2_strobe_out_n_NC] [get_bd_ports tx2_strobe_out_n]
connect_bd_net [get_bd_pins axi_adrv9001/tx2_strobe_out_p_strobe_out] [get_bd_ports tx2_strobe_out_p]
connect_bd_net [get_bd_pins axi_hdmi_clkgen/clk_0] [get_bd_pins axi_hdmi_core/reference_clk]
connect_bd_net [get_bd_pins axi_hdmi_core/hdmi_16_data] [get_bd_ports hdmi_data]
connect_bd_net [get_bd_pins axi_hdmi_core/hdmi_16_data_e] [get_bd_ports hdmi_data_e]
connect_bd_net [get_bd_pins axi_hdmi_core/hdmi_16_hsync] [get_bd_ports hdmi_hsync]
connect_bd_net [get_bd_pins axi_hdmi_core/hdmi_16_vsync] [get_bd_ports hdmi_vsync]
connect_bd_net [get_bd_pins axi_hdmi_core/hdmi_out_clk] [get_bd_ports hdmi_out_clk]
connect_bd_net [get_bd_pins axi_hdmi_dma/irq] [get_bd_pins sys_concat_intc/In15]
connect_bd_net [get_bd_pins axi_iic_fmc/iic2intc_irpt] [get_bd_pins sys_concat_intc/In11]
connect_bd_net [get_bd_pins axi_iic_main/iic2intc_irpt] [get_bd_pins sys_concat_intc/In14]
connect_bd_net [get_bd_pins axi_spdif_tx_core/spdif_tx_o] [get_bd_ports spdif]
connect_bd_net [get_bd_pins axi_sysid_0/rom_addr] [get_bd_pins rom_sys_0/rom_addr]
connect_bd_net [get_bd_ports gpio_i] [get_bd_pins sys_ps7/GPIO_I]
connect_bd_net [get_bd_ports gpio_rx1_enable_in] [get_bd_pins axi_adrv9001/gpio_rx1_enable_in]
connect_bd_net [get_bd_ports gpio_rx2_enable_in] [get_bd_pins axi_adrv9001/gpio_rx2_enable_in]
connect_bd_net [get_bd_ports gpio_tx1_enable_in] [get_bd_pins axi_adrv9001/gpio_tx1_enable_in]
connect_bd_net [get_bd_ports gpio_tx2_enable_in] [get_bd_pins axi_adrv9001/gpio_tx2_enable_in]
connect_bd_net [get_bd_ports iic_mux_scl_i] [get_bd_pins sys_i2c_mixer/downstream_scl_I]
connect_bd_net [get_bd_ports iic_mux_sda_i] [get_bd_pins sys_i2c_mixer/downstream_sda_I]
connect_bd_net [get_bd_ports mssi_sync] [get_bd_pins axi_adrv9001/mssi_sync]
connect_bd_net [get_bd_ports otg_vbusoc] [get_bd_pins sys_logic_inv/Op1]
connect_bd_net [get_bd_ports ref_clk] [get_bd_pins axi_adrv9001/ref_clk]
connect_bd_net [get_bd_pins rom_sys_0/rom_data] [get_bd_pins axi_sysid_0/sys_rom_data]
connect_bd_net [get_bd_ports rx1_dclk_in_n] [get_bd_pins axi_adrv9001/rx1_dclk_in_n_NC]
connect_bd_net [get_bd_ports rx1_dclk_in_p] [get_bd_pins axi_adrv9001/rx1_dclk_in_p_dclk_in]
connect_bd_net [get_bd_ports rx1_idata_in_n] [get_bd_pins axi_adrv9001/rx1_idata_in_n_idata0]
connect_bd_net [get_bd_ports rx1_idata_in_p] [get_bd_pins axi_adrv9001/rx1_idata_in_p_idata1]
connect_bd_net [get_bd_ports rx1_qdata_in_n] [get_bd_pins axi_adrv9001/rx1_qdata_in_n_qdata2]
connect_bd_net [get_bd_ports rx1_qdata_in_p] [get_bd_pins axi_adrv9001/rx1_qdata_in_p_qdata3]
connect_bd_net [get_bd_ports rx1_strobe_in_n] [get_bd_pins axi_adrv9001/rx1_strobe_in_n_NC]
connect_bd_net [get_bd_ports rx1_strobe_in_p] [get_bd_pins axi_adrv9001/rx1_strobe_in_p_strobe_in]
connect_bd_net [get_bd_ports rx2_dclk_in_n] [get_bd_pins axi_adrv9001/rx2_dclk_in_n_NC]
connect_bd_net [get_bd_ports rx2_dclk_in_p] [get_bd_pins axi_adrv9001/rx2_dclk_in_p_dclk_in]
connect_bd_net [get_bd_ports rx2_idata_in_n] [get_bd_pins axi_adrv9001/rx2_idata_in_n_idata0]
connect_bd_net [get_bd_ports rx2_idata_in_p] [get_bd_pins axi_adrv9001/rx2_idata_in_p_idata1]
connect_bd_net [get_bd_ports rx2_qdata_in_n] [get_bd_pins axi_adrv9001/rx2_qdata_in_n_qdata2]
connect_bd_net [get_bd_ports rx2_qdata_in_p] [get_bd_pins axi_adrv9001/rx2_qdata_in_p_qdata3]
connect_bd_net [get_bd_ports rx2_strobe_in_n] [get_bd_pins axi_adrv9001/rx2_strobe_in_n_NC]
connect_bd_net [get_bd_ports rx2_strobe_in_p] [get_bd_pins axi_adrv9001/rx2_strobe_in_p_strobe_in]
connect_bd_net [get_bd_ports spi0_clk_i] [get_bd_pins sys_ps7/SPI0_SCLK_I]
connect_bd_net [get_bd_ports spi0_csn_i] [get_bd_pins sys_ps7/SPI0_SS_I]
connect_bd_net [get_bd_ports spi0_sdi_i] [get_bd_pins sys_ps7/SPI0_MISO_I]
connect_bd_net [get_bd_ports spi0_sdo_i] [get_bd_pins sys_ps7/SPI0_MOSI_I]
connect_bd_net [get_bd_ports spi1_clk_i] [get_bd_pins sys_ps7/SPI1_SCLK_I]
connect_bd_net [get_bd_ports spi1_csn_i] [get_bd_pins sys_ps7/SPI1_SS_I]
connect_bd_net [get_bd_ports spi1_sdi_i] [get_bd_pins sys_ps7/SPI1_MISO_I]
connect_bd_net [get_bd_ports spi1_sdo_i] [get_bd_pins sys_ps7/SPI1_MOSI_I]
connect_bd_net -net sys_200m_clk [get_bd_pins sys_ps7/FCLK_CLK1] \
  [get_bd_pins axi_hdmi_clkgen/clk] [get_bd_pins sys_200m_rstgen/slowest_sync_clk] [get_bd_pins sys_audio_clkgen/clk_in1] \
  [get_bd_pins axi_adrv9001/delay_clk]
# net sys_200m_reset has one end: sys_200m_rstgen/peripheral_reset
# net sys_200m_resetn has one end: sys_200m_rstgen/peripheral_aresetn
connect_bd_net [get_bd_pins sys_audio_clkgen/clk_out1] \
  [get_bd_pins axi_spdif_tx_core/spdif_data_clk] [get_bd_ports i2s_mclk] [get_bd_pins axi_i2s_adi/data_clk_i]
connect_bd_net [get_bd_pins sys_concat_intc/dout] [get_bd_pins sys_ps7/IRQ_F2P]
connect_bd_net -net sys_cpu_clk [get_bd_pins sys_ps7/FCLK_CLK0] \
  [get_bd_pins axi_hdmi_core/vdma_clk] [get_bd_pins axi_hdmi_dma/s_axi_aclk] [get_bd_pins axi_hdmi_dma/m_src_axi_aclk] \
  [get_bd_pins axi_hdmi_dma/m_axis_aclk] [get_bd_pins axi_spdif_tx_core/dma_req_aclk] [get_bd_pins sys_ps7/DMA0_ACLK] \
  [get_bd_pins axi_i2s_adi/dma_req_rx_aclk] [get_bd_pins axi_i2s_adi/dma_req_tx_aclk] [get_bd_pins sys_ps7/DMA1_ACLK] \
  [get_bd_pins sys_ps7/DMA2_ACLK] [get_bd_pins rom_sys_0/clk] [get_bd_pins sys_ps7/M_AXI_GP0_ACLK] \
  [get_bd_pins axi_sysid_0/s_axi_aclk] [get_bd_pins axi_hdmi_clkgen/s_axi_aclk] [get_bd_pins axi_hdmi_core/s_axi_aclk] \
  [get_bd_pins axi_spdif_tx_core/s_axi_aclk] [get_bd_pins axi_i2s_adi/s_axi_aclk] [get_bd_pins sys_ps7/S_AXI_HP0_ACLK] \
  [get_bd_pins axi_adrv9001_rx1_dma/s_axi_aclk] [get_bd_pins axi_adrv9001_rx2_dma/s_axi_aclk] \
  [get_bd_pins axi_adrv9001_tx1_dma/s_axi_aclk] [get_bd_pins axi_adrv9001_tx2_dma/s_axi_aclk] \
  [get_bd_pins sys_ps7/S_AXI_HP1_ACLK] [get_bd_pins axi_adrv9001_rx1_dma/m_dest_axi_aclk] \
  [get_bd_pins axi_adrv9001_rx2_dma/m_dest_axi_aclk] [get_bd_pins axi_adrv9001_tx1_dma/m_src_axi_aclk] \
  [get_bd_pins axi_adrv9001_tx2_dma/m_src_axi_aclk] [get_bd_pins axi_cpu_interconnect/ACLK] \
  [get_bd_pins axi_cpu_interconnect/S00_ACLK] [get_bd_pins axi_cpu_interconnect/M00_ACLK] \
  [get_bd_pins axi_cpu_interconnect/M01_ACLK] [get_bd_pins axi_cpu_interconnect/M02_ACLK] \
  [get_bd_pins axi_cpu_interconnect/M03_ACLK] [get_bd_pins axi_cpu_interconnect/M04_ACLK] \
  [get_bd_pins axi_cpu_interconnect/M05_ACLK] [get_bd_pins axi_cpu_interconnect/M06_ACLK] \
  [get_bd_pins axi_cpu_interconnect/M07_ACLK] [get_bd_pins axi_cpu_interconnect/M08_ACLK] \
  [get_bd_pins axi_cpu_interconnect/M09_ACLK] [get_bd_pins axi_cpu_interconnect/M10_ACLK] \
  [get_bd_pins axi_cpu_interconnect/M11_ACLK] [get_bd_pins axi_cpu_interconnect/M12_ACLK] \
  [get_bd_pins axi_hp0_interconnect/aclk] [get_bd_pins axi_hp1_interconnect/aclk] [get_bd_pins axi_iic_fmc/s_axi_aclk] \
  [get_bd_pins axi_iic_main/s_axi_aclk] [get_bd_pins sys_rstgen/slowest_sync_clk] [get_bd_pins axi_cpu_interconnect/M13_ACLK] \
  [get_bd_pins axi_adrv9001/s_axi_aclk] [get_bd_pins IP_802_11p_0/CLOCK] [get_bd_pins IP_802_11p_0/s00_axi_aclk]
# net sys_cpu_reset has one end: sys_rstgen/peripheral_reset
connect_bd_net -net sys_cpu_resetn [get_bd_pins sys_rstgen/peripheral_aresetn] \
  [get_bd_pins axi_hdmi_dma/s_axi_aresetn] [get_bd_pins axi_hdmi_dma/m_src_axi_aresetn] \
  [get_bd_pins axi_spdif_tx_core/dma_req_rstn] [get_bd_pins axi_i2s_adi/dma_req_tx_rstn] \
  [get_bd_pins axi_i2s_adi/dma_req_rx_rstn] [get_bd_pins axi_sysid_0/s_axi_aresetn] \
  [get_bd_pins axi_hdmi_clkgen/s_axi_aresetn] [get_bd_pins axi_hdmi_core/s_axi_aresetn] \
  [get_bd_pins axi_spdif_tx_core/s_axi_aresetn] [get_bd_pins axi_i2s_adi/s_axi_aresetn] \
  [get_bd_pins axi_adrv9001_rx1_dma/s_axi_aresetn] [get_bd_pins axi_adrv9001_rx2_dma/s_axi_aresetn] \
  [get_bd_pins axi_adrv9001_tx1_dma/s_axi_aresetn] [get_bd_pins axi_adrv9001_tx2_dma/s_axi_aresetn] \
  [get_bd_pins axi_adrv9001_rx1_dma/m_dest_axi_aresetn] [get_bd_pins axi_adrv9001_rx2_dma/m_dest_axi_aresetn] \
  [get_bd_pins axi_adrv9001_tx1_dma/m_src_axi_aresetn] [get_bd_pins axi_adrv9001_tx2_dma/m_src_axi_aresetn] \
  [get_bd_pins axi_cpu_interconnect/ARESETN] [get_bd_pins axi_cpu_interconnect/S00_ARESETN] \
  [get_bd_pins axi_cpu_interconnect/M00_ARESETN] [get_bd_pins axi_cpu_interconnect/M01_ARESETN] \
  [get_bd_pins axi_cpu_interconnect/M02_ARESETN] [get_bd_pins axi_cpu_interconnect/M03_ARESETN] \
  [get_bd_pins axi_cpu_interconnect/M04_ARESETN] [get_bd_pins axi_cpu_interconnect/M05_ARESETN] \
  [get_bd_pins axi_cpu_interconnect/M06_ARESETN] [get_bd_pins axi_cpu_interconnect/M07_ARESETN] \
  [get_bd_pins axi_cpu_interconnect/M08_ARESETN] [get_bd_pins axi_cpu_interconnect/M09_ARESETN] \
  [get_bd_pins axi_cpu_interconnect/M10_ARESETN] [get_bd_pins axi_cpu_interconnect/M11_ARESETN] \
  [get_bd_pins axi_cpu_interconnect/M12_ARESETN] [get_bd_pins axi_hp0_interconnect/aresetn] \
  [get_bd_pins axi_hp1_interconnect/aresetn] [get_bd_pins axi_iic_fmc/s_axi_aresetn] [get_bd_pins axi_iic_main/s_axi_aresetn] \
  [get_bd_pins sys_audio_clkgen/resetn] [get_bd_pins axi_cpu_interconnect/M13_ARESETN] \
  [get_bd_pins axi_adrv9001/s_axi_aresetn] [get_bd_pins IP_802_11p_0/s00_axi_aresetn]
connect_bd_net [get_bd_pins sys_i2c_mixer/downstream_scl_O] [get_bd_ports iic_mux_scl_o]
connect_bd_net [get_bd_pins sys_i2c_mixer/downstream_scl_T] [get_bd_ports iic_mux_scl_t]
connect_bd_net [get_bd_pins sys_i2c_mixer/downstream_sda_O] [get_bd_ports iic_mux_sda_o]
connect_bd_net [get_bd_pins sys_i2c_mixer/downstream_sda_T] [get_bd_ports iic_mux_sda_t]
connect_bd_net [get_bd_pins sys_logic_inv/Res] [get_bd_pins sys_ps7/USB0_VBUS_PWRFAULT]
connect_bd_net [get_bd_pins sys_ps7/FCLK_RESET0_N] [get_bd_pins sys_rstgen/ext_reset_in]
connect_bd_net [get_bd_pins sys_ps7/FCLK_RESET1_N] [get_bd_pins sys_200m_rstgen/ext_reset_in]
connect_bd_net [get_bd_pins sys_ps7/GPIO_O] [get_bd_ports gpio_o]
connect_bd_net [get_bd_pins sys_ps7/GPIO_T] [get_bd_ports gpio_t]
connect_bd_net [get_bd_pins sys_ps7/SPI0_MOSI_O] [get_bd_ports spi0_sdo_o]
connect_bd_net [get_bd_pins sys_ps7/SPI0_SCLK_O] [get_bd_ports spi0_clk_o]
connect_bd_net [get_bd_pins sys_ps7/SPI0_SS1_O] [get_bd_ports spi0_csn_1_o]
connect_bd_net [get_bd_pins sys_ps7/SPI0_SS2_O] [get_bd_ports spi0_csn_2_o]
connect_bd_net [get_bd_pins sys_ps7/SPI0_SS_O] [get_bd_ports spi0_csn_0_o]
connect_bd_net [get_bd_pins sys_ps7/SPI1_MOSI_O] [get_bd_ports spi1_sdo_o]
connect_bd_net [get_bd_pins sys_ps7/SPI1_SCLK_O] [get_bd_ports spi1_clk_o]
connect_bd_net [get_bd_pins sys_ps7/SPI1_SS1_O] [get_bd_ports spi1_csn_1_o]
connect_bd_net [get_bd_pins sys_ps7/SPI1_SS2_O] [get_bd_ports spi1_csn_2_o]
connect_bd_net [get_bd_pins sys_ps7/SPI1_SS_O] [get_bd_ports spi1_csn_0_o]
connect_bd_net [get_bd_ports tdd_sync] [get_bd_pins axi_adrv9001/tdd_sync]
connect_bd_net [get_bd_ports tx1_dclk_in_n] [get_bd_pins axi_adrv9001/tx1_dclk_in_n_NC]
connect_bd_net [get_bd_ports tx1_dclk_in_p] [get_bd_pins axi_adrv9001/tx1_dclk_in_p_dclk_in]
connect_bd_net [get_bd_ports tx2_dclk_in_n] [get_bd_pins axi_adrv9001/tx2_dclk_in_n_NC]
connect_bd_net [get_bd_ports tx2_dclk_in_p] [get_bd_pins axi_adrv9001/tx2_dclk_in_p_dclk_in]
connect_bd_net [get_bd_ports tx_output_enable] [get_bd_pins axi_adrv9001/tx_output_enable]
connect_bd_net [get_bd_pins util_adc_1_pack/fifo_wr_overflow] [get_bd_pins axi_adrv9001/adc_1_dovf]
connect_bd_net [get_bd_pins util_adc_2_pack/fifo_wr_overflow] [get_bd_pins axi_adrv9001/adc_2_dovf]
connect_bd_net [get_bd_pins util_dac_1_upack/fifo_rd_data_0] [get_bd_pins axi_adrv9001/dac_1_data_i0]
connect_bd_net [get_bd_pins util_dac_1_upack/fifo_rd_data_1] [get_bd_pins axi_adrv9001/dac_1_data_q0]
connect_bd_net [get_bd_pins util_dac_1_upack/fifo_rd_data_2] [get_bd_pins axi_adrv9001/dac_1_data_i1]
connect_bd_net [get_bd_pins util_dac_1_upack/fifo_rd_data_3] [get_bd_pins axi_adrv9001/dac_1_data_q1]
connect_bd_net [get_bd_pins util_dac_1_upack/fifo_rd_underflow] [get_bd_pins axi_adrv9001/dac_1_dunf]
connect_bd_net [get_bd_pins util_dac_2_upack/fifo_rd_data_0] [get_bd_pins axi_adrv9001/dac_2_data_i0]
connect_bd_net [get_bd_pins util_dac_2_upack/fifo_rd_data_1] [get_bd_pins axi_adrv9001/dac_2_data_q0]
connect_bd_net [get_bd_pins util_dac_2_upack/fifo_rd_underflow] [get_bd_pins axi_adrv9001/dac_2_dunf]

# ---- address map ----
assign_bd_address -offset 0x00000000 -range 512M -target_address_space [get_bd_addr_spaces axi_adrv9001_rx1_dma/m_dest_axi] [get_bd_addr_segs sys_ps7/S_AXI_HP1/HP1_DDR_LOWOCM]
assign_bd_address -offset 0x00000000 -range 512M -target_address_space [get_bd_addr_spaces axi_adrv9001_rx2_dma/m_dest_axi] [get_bd_addr_segs sys_ps7/S_AXI_HP1/HP1_DDR_LOWOCM]
assign_bd_address -offset 0x00000000 -range 512M -target_address_space [get_bd_addr_spaces axi_adrv9001_tx1_dma/m_src_axi] [get_bd_addr_segs sys_ps7/S_AXI_HP1/HP1_DDR_LOWOCM]
assign_bd_address -offset 0x00000000 -range 512M -target_address_space [get_bd_addr_spaces axi_adrv9001_tx2_dma/m_src_axi] [get_bd_addr_segs sys_ps7/S_AXI_HP1/HP1_DDR_LOWOCM]
assign_bd_address -offset 0x00000000 -range 512M -target_address_space [get_bd_addr_spaces axi_hdmi_dma/m_src_axi] [get_bd_addr_segs sys_ps7/S_AXI_HP0/HP0_DDR_LOWOCM]
assign_bd_address -offset 0x41600000 -range 4K -target_address_space [get_bd_addr_spaces sys_ps7/Data] [get_bd_addr_segs axi_iic_main/S_AXI/Reg]
assign_bd_address -offset 0x41620000 -range 4K -target_address_space [get_bd_addr_spaces sys_ps7/Data] [get_bd_addr_segs axi_iic_fmc/S_AXI/Reg]
assign_bd_address -offset 0x43000000 -range 4K -target_address_space [get_bd_addr_spaces sys_ps7/Data] [get_bd_addr_segs axi_hdmi_dma/s_axi/axi_lite]
assign_bd_address -offset 0x44A00000 -range 64K -target_address_space [get_bd_addr_spaces sys_ps7/Data] [get_bd_addr_segs axi_adrv9001/s_axi/axi_lite]
assign_bd_address -offset 0x44A30000 -range 4K -target_address_space [get_bd_addr_spaces sys_ps7/Data] [get_bd_addr_segs axi_adrv9001_rx1_dma/s_axi/axi_lite]
assign_bd_address -offset 0x44A40000 -range 4K -target_address_space [get_bd_addr_spaces sys_ps7/Data] [get_bd_addr_segs axi_adrv9001_rx2_dma/s_axi/axi_lite]
assign_bd_address -offset 0x44A50000 -range 4K -target_address_space [get_bd_addr_spaces sys_ps7/Data] [get_bd_addr_segs axi_adrv9001_tx1_dma/s_axi/axi_lite]
assign_bd_address -offset 0x44A60000 -range 4K -target_address_space [get_bd_addr_spaces sys_ps7/Data] [get_bd_addr_segs axi_adrv9001_tx2_dma/s_axi/axi_lite]
assign_bd_address -offset 0x45000000 -range 64K -target_address_space [get_bd_addr_spaces sys_ps7/Data] [get_bd_addr_segs axi_sysid_0/s_axi/axi_lite]
assign_bd_address -offset 0x50000000 -range 16K -target_address_space [get_bd_addr_spaces sys_ps7/Data] [get_bd_addr_segs IP_802_11p_0/S00_AXI/S00_AXI_reg]
assign_bd_address -offset 0x70E00000 -range 64K -target_address_space [get_bd_addr_spaces sys_ps7/Data] [get_bd_addr_segs axi_hdmi_core/s_axi/axi_lite]
assign_bd_address -offset 0x75C00000 -range 64K -target_address_space [get_bd_addr_spaces sys_ps7/Data] [get_bd_addr_segs axi_spdif_tx_core/s_axi/axi_lite]
assign_bd_address -offset 0x77600000 -range 64K -target_address_space [get_bd_addr_spaces sys_ps7/Data] [get_bd_addr_segs axi_i2s_adi/s_axi/axi_lite]
assign_bd_address -offset 0x79000000 -range 64K -target_address_space [get_bd_addr_spaces sys_ps7/Data] [get_bd_addr_segs axi_hdmi_clkgen/s_axi/axi_lite]

validate_bd_design
save_bd_design
